# EAGLE design doodle 8 with step and l293 (EAGLE 6.2)
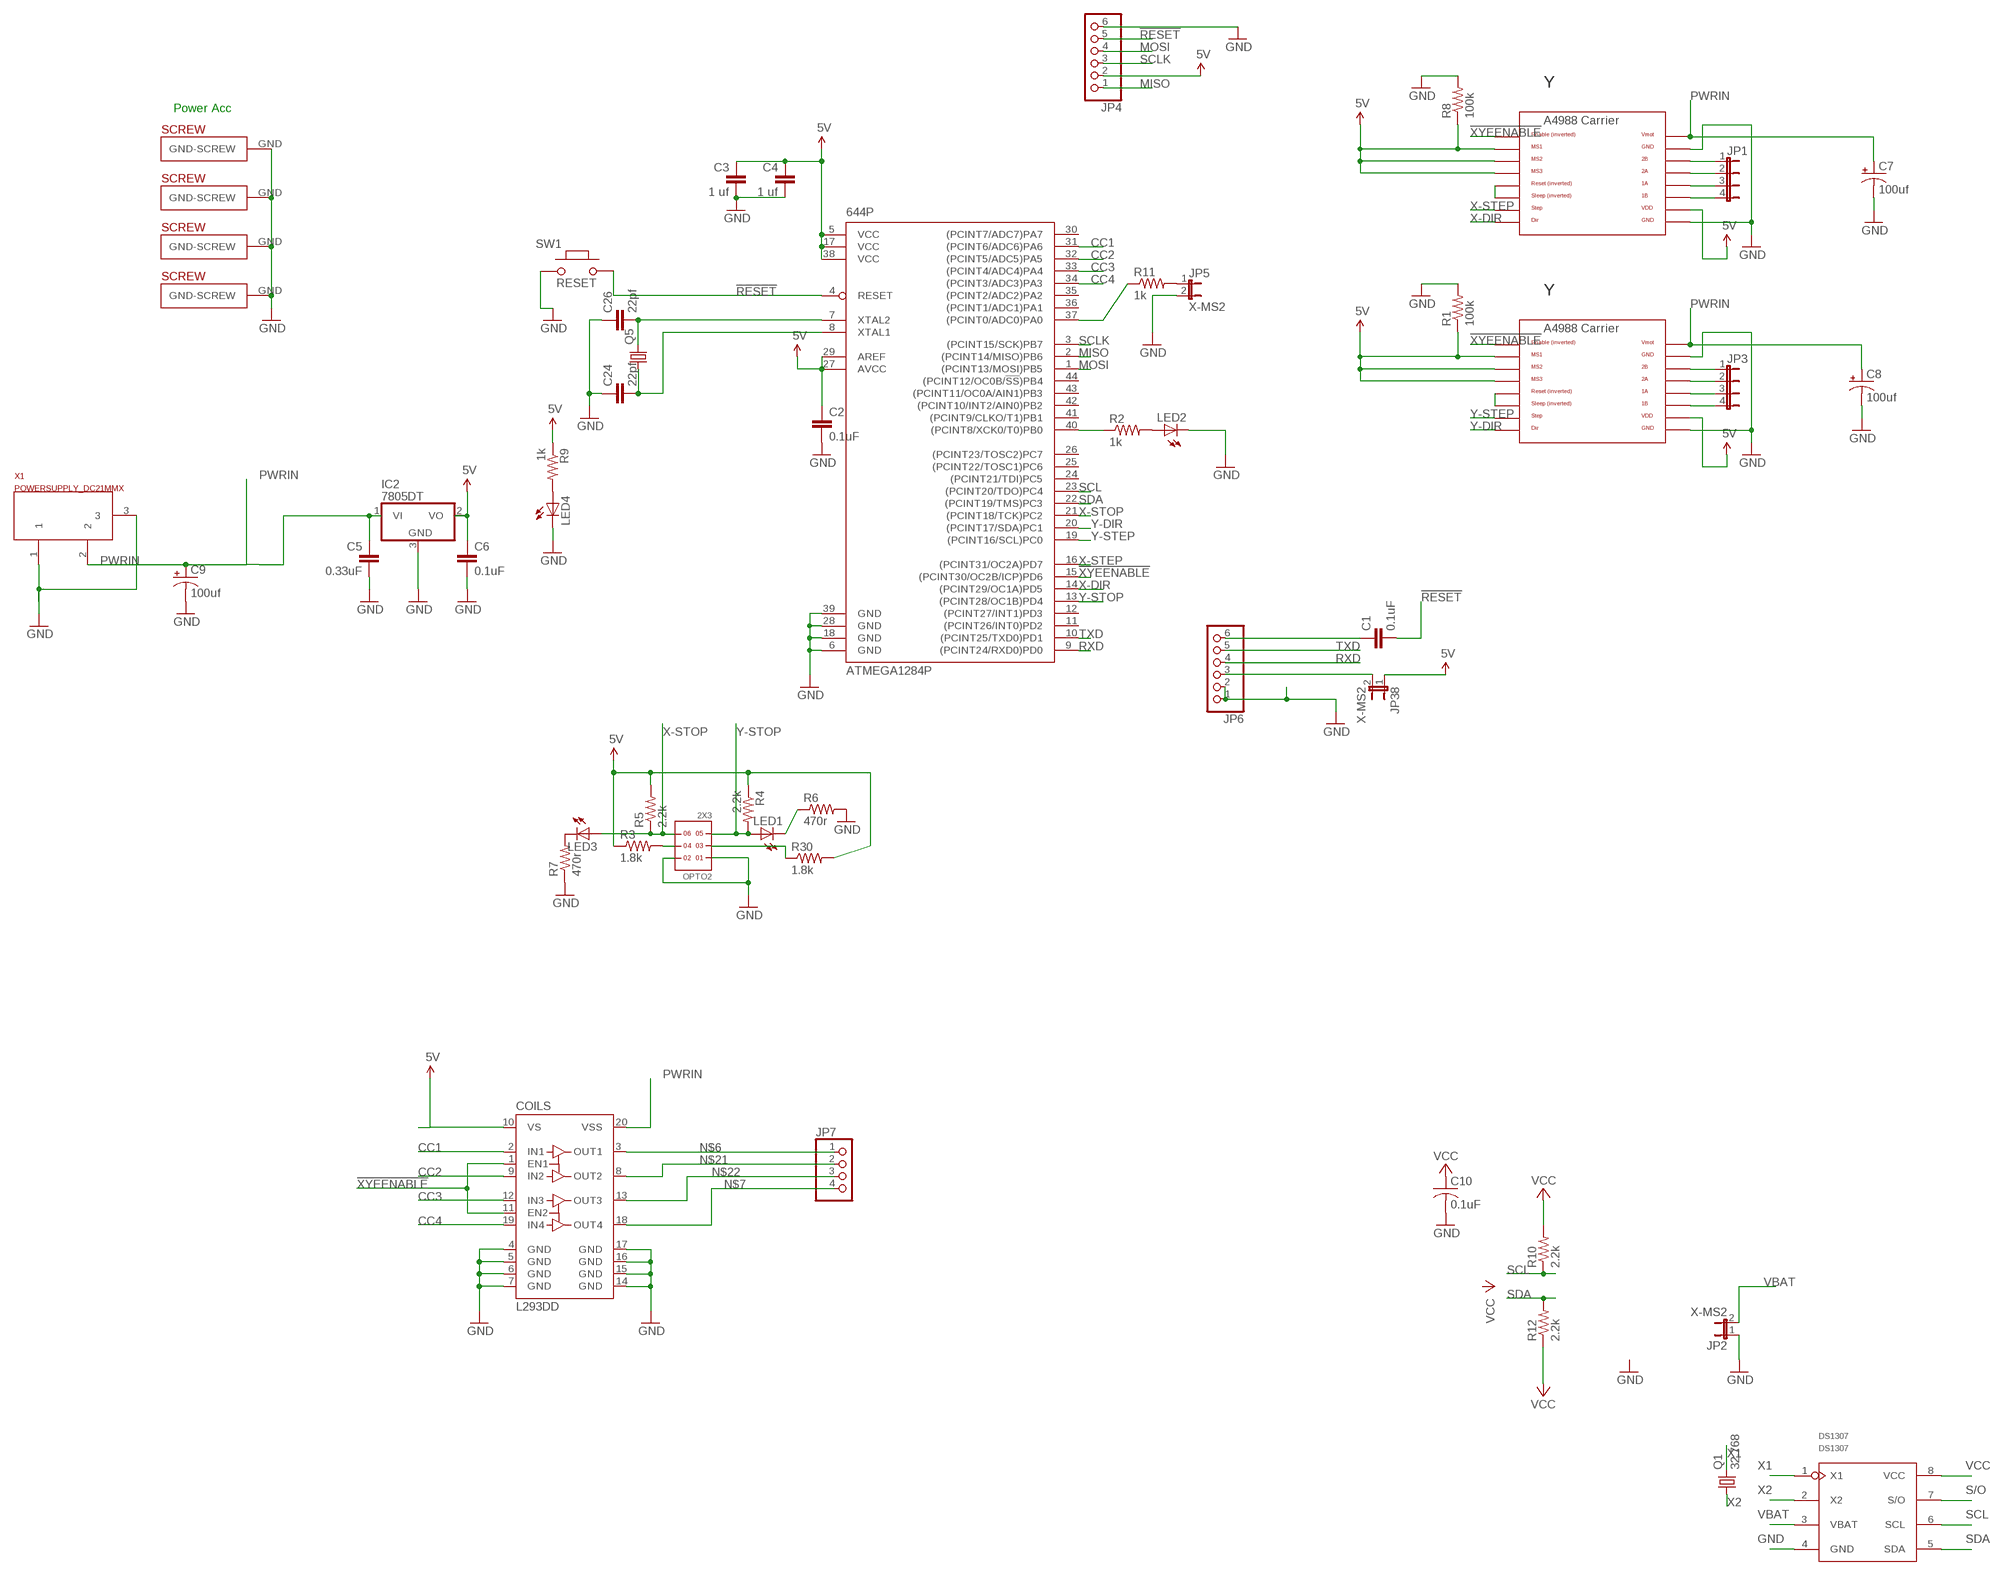
[diagram p0: schematic, sheet 1]

## Parts
644P  ATMEGA1284P  ATMEGA644A  [TQFP44]
C1  0.1uF  CAP0805  [0805]
C2  0.1uF  CAP0805  [0805]
C3  1 uf  CAP0805  [0805]
C4  1 uf  CAP0805  [0805]
C5  0.33uF  CAPPTH2  [CAP-PTH-SMALL2]
C6  0.1uF  CAPPTH2  [CAP-PTH-SMALL2]
C7  100uf  CAP_POLPTH1  [CPOL-RADIAL-100UF-25V]
C8  100uf  CAP_POLPTH1  [CPOL-RADIAL-100UF-25V]
C9  100uf  CAP_POLPTH1  [CPOL-RADIAL-100UF-25V]
C10  0.1uF  C-USC0805  [C0805]
C24  22pf  CAP0805  [0805]
C26  22pf  CAP0805  [0805]
COILS  L293DD  [SO20]
DS1307  DS1307  [SO08]
IC2  7805DT  [TO252]
JP1  JP4E  [JP4]
JP2  X-MS2  JUMPER-2PTH  [1X02]
JP3  JP4E  [JP4]
JP4  PINHD-1X6/90  [1X06/90]
JP5  X-MS2  JUMPER-2PTH  [1X02]
JP6  PINHD-1X6  [1X06]
JP7  PINHD-1X04_2.54  [1X04]
JP38  X-MS2  JUMPER-2PTH  [1X02]
LED1  LEDCHIPLED_0805  [CHIPLED_0805]
LED2  LEDCHIPLED_0805  [CHIPLED_0805]
LED3  LEDCHIPLED_0805  [CHIPLED_0805]
LED4  LEDCHIPLED_0805  [CHIPLED_0805]
OPTO2  2X3  [2X3]
Q1  32.768  CRYTALTC38H  [TC38H]
Q5  CRYSTALHC49S  [HC49/S]
R1  100k  R-US_R0805  [R0805]
R2  1k  R-US_R0805  [R0805]
R3  1.8k  R-US_R0805  [R0805]
R4  2.2k  R-US_R0805  [R0805]
R5  2.2k  R-US_R0805  [R0805]
R6  470r  R-US_R0805  [R0805]
R7  470r  R-US_R0805  [R0805]
R8  100k  R-US_R0805  [R0805]
R9  1k  R-US_R0805  [R0805]
R10  2.2k  R-US_R0805  [R0805]
R11  1k  R-US_R0805  [R0805]
R12  2.2k  R-US_R0805  [R0805]
R30  1.8k  R-US_R0603  [R0603]
SW1  RESET  PB157  [157SW]
U$1  A4988BREAKOUT  [A4988BREAKOUT]
U$7  A4988BREAKOUT  [A4988BREAKOUT]
U$14  PLATED-SCREW  [PLATEDSCREW]
U$17  PLATED-SCREW  [PLATEDSCREW]
U$18  PLATED-SCREW  [PLATEDSCREW]
U$38  PLATED-SCREW  [PLATEDSCREW]
X1  POWERSUPPLY_DC21MMX  [POWERSUPPLY_DC-21MM]

## Nets
5V: 644P.5(VCC) 644P.17(VCC) 644P.27(AVCC) 644P.29(AREF) 644P.38(VCC) C2.1 C3.1 C4.1 C6.1 COILS.10(VS) IC2.2(VO) JP4.2 JP38.1 R1.1 R3.1 R4.1 R5.2 R8.1 R9.1 R30.2 U$1.MS1 U$1.MS2 U$1.MS3 U$1.VDD U$7.MS1 U$7.MS2 U$7.MS3 U$7.VDD
!RESET: 644P.4(RESET) C1.2 JP4.5 SW1.2
!XYEENABLE: 644P.15((PCINT30/OC2B/ICP)PD6) COILS.1(EN1) COILS.11(EN2) U$1.EN U$7.EN
CC1: 644P.31((PCINT6/ADC6)PA6) COILS.2(IN1)
CC2: 644P.32((PCINT5/ADC5)PA5) COILS.9(IN2)
CC3: 644P.33((PCINT4/ADC4)PA4) COILS.12(IN3)
CC4: 644P.34((PCINT3/ADC3)PA3) COILS.19(IN4)
GND: 644P.6(GND) 644P.18(GND) 644P.28(GND) 644P.39(GND) C2.2 C3.2 C4.2 C5.2 C6.2 C7.2(-) C8.2(-) C9.2(-) C10.2 C24.1 C26.1 COILS.4(GND) COILS.5(GND) COILS.6(GND) COILS.7(GND) COILS.14(GND) COILS.15(GND) COILS.16(GND) COILS.17(GND) DS1307.4(GND) IC2.3(GND) JP2.1 JP4.6 JP5.2 JP6.1 JP6.2 LED2.C LED4.C OPTO2.1 OPTO2.2 R1.2 R6.2 R7.1 R8.2 SW1.1 U$1.GND U$1.GND@0(GND) U$7.GND U$7.GND@0(GND) U$14.GND(GND-SCREW) U$17.GND(GND-SCREW) U$18.GND(GND-SCREW) U$38.GND(GND-SCREW) X1.1 X1.3
MISO: 644P.2((PCINT14/MISO)PB6) JP4.1
MOSI: 644P.1((PCINT13/MOSI)PB5) JP4.4
N$1: U$1.RST U$1.SLP(SLEEP)
N$2 [power]: JP3.1 U$1.2B
N$3 [power]: JP3.2 U$1.2A
N$4 [power]: JP3.3 U$1.1A
N$5 [power]: JP3.4 U$1.1B
N$6 [power]: COILS.3(OUT1) JP7.1
N$7 [power]: COILS.18(OUT4) JP7.4
N$8: OPTO2.4 R3.2
N$9: LED2.A R2.2
N$10: 644P.40((PCINT8/XCK0/T0)PB0) R2.1
N$11: LED1.C R6.1
N$12: LED3.C R7.2
N$13: OPTO2.3 R30.1
N$14 [power]: JP1.1 U$7.2B
N$15 [power]: JP1.2 U$7.2A
N$16 [power]: JP1.3 U$7.1A
N$17 [power]: JP1.4 U$7.1B
N$18: 644P.37((PCINT0/ADC0)PA0) R11.1
N$19: LED4.A R9.2
N$20: JP5.1 R11.2
N$21 [power]: COILS.8(OUT2) JP7.2
N$22 [power]: COILS.13(OUT3) JP7.3
N$23: U$7.RST U$7.SLP(SLEEP)
N$70: C1.1 JP6.6
N$71: JP6.3 JP38.2
N$80: 644P.7(XTAL2) C26.2 Q5.2
N$81: 644P.8(XTAL1) C24.2 Q5.1
PWRIN [power]: C5.1 C7.1(+) C8.1(+) C9.1(+) COILS.20(VSS) IC2.1(VI) U$1.VMOT U$7.VMOT X1.2
RXD: 644P.9((PCINT24/RXD0)PD0) JP6.4
S/O: DS1307.7(S/O)
SCL: 644P.23((PCINT20/TDO)PC4) DS1307.6(SCL) R10.1
SCLK: 644P.3((PCINT15/SCK)PB7) JP4.3
SDA: 644P.22((PCINT19/TMS)PC3) DS1307.5(SDA) R12.2
TXD: 644P.10((PCINT25/TXD0)PD1) JP6.5
VBAT: DS1307.3(VBAT) JP2.2
VCC: C10.1 DS1307.8(VCC) R10.2 R12.1
X1: DS1307.1(X1) Q1.2
X2: DS1307.2(X2) Q1.1
X-DIR: 644P.14((PCINT29/OC1A)PD5) U$7.DIR
X-STEP: 644P.16((PCINT31/OC2A)PD7) U$7.STEP
X-STOP: 644P.21((PCINT18/TCK)PC2) LED3.A OPTO2.6 R5.1
Y-DIR: 644P.20((PCINT17/SDA)PC1) U$1.DIR
Y-STEP: 644P.19((PCINT16/SCL)PC0) U$1.STEP
Y-STOP: 644P.13((PCINT28/OC1B)PD4) LED1.A OPTO2.5 R4.2
Unconnected: 644P.11((PCINT26/INT0)PD2) 644P.12((PCINT27/INT1)PD3) 644P.24((PCINT21/TDI)PC5) 644P.25((PCINT22/TOSC1)PC6) 644P.26((PCINT23/TOSC2)PC7) 644P.30((PCINT7/ADC7)PA7) 644P.35((PCINT2/ADC2)PA2) 644P.36((PCINT1/ADC1)PA1) 644P.41((PCINT9/CLKO/T1)PB1) 644P.42((PCINT10/INT2/AIN0)PB2) 644P.43((PCINT11/OC0A/AIN1)PB3) 644P.44((PCINT12/OC0B/!SS!)PB4)

## Notes on the sheet
- Y
- Power Acc
- Y

## Library data of the parts
644P = atmel:ATMEGA644: 8-bit Microcontroller with 64K Bytes In-System Programmable Flash Source: http://www.atmel.com/dyn/resources/prod_documents/doc2593.pdf; MPN: ATMEGA644PV-10AU; OC_FARNELL: 1455123; OC_NEWARK: 58M3748
C1-C6 C24 C26 = SparkFun:CAP: Capacitor Standard 0603 ceramic capacitor, and 0.1" leaded capacitor.
C7-C9 = SparkFun:CAP_POL: Capacitor Polarized These are standard SMD and PTH capacitors. Normally 10uF, 47uF, and 100uF in electrolytic and tantalum varieties. Always verify the external diameter of the through hole cap, it varies with capacity, voltage, and manufacturer. The EIA devices should be standard.
C10 = adafruit:C-US: CAPACITOR, American symbol
COILS = st-microelectronics:L293DD: PUSH-PULL FOUR CHANNEL DRIVER WITH DIODES Source: http://www.st.com/stonline/books/pdf/docs/1330.pdf; OC_FARNELL: unknown
DS1307 = Seeed:DS1307
IC2 = linear:78*: Positive VOLTAGE REGULATOR Source: http://cache.national.com/ds/LM/LM78L05.pdf http://www.fairchildsemi.com/ds/LM/LM7805.pdf
JP1 JP3 = jumper:JP4E: JUMPER
JP2 JP5 JP38 = SparkFun:JUMPER-2: Jumper Basic 0.1" spaced jumper. Use with breakaway headers.
JP4 JP6 = pinhead:PINHD-1X6: PIN HEADER
JP7 = pinhead-2:PINHD-1X04: PIN HEADER
LED1-LED4 = led:LED: LED OSRAM: - CHIPLED LG R971, LG N971, LY N971, LG Q971, LY Q971, LO R971, LY R971 LH N974, LH R974 LS Q976, LO Q976, LY Q976 LO Q996 - Hyper CHIPLED LW Q18S LB Q993, LB Q99A, LB R99A - SideLED LS A670, LO A670, LY A670, LG A670, LP A670 LB A673, LV A673, LT A673, LW A673 LH A674 LY A675 LS A676, LA A676, LO A676, LY A676, LW A676 LS A679, LY A679, LG A679 - Hyper Micro SIDELED® LS Y876, LA Y876, LO Y876, LY Y876 LT Y87S - SmartLED LW L88C, LW L88S LB L89C, LB L89S, LG L890 LS L89K, LO L89K, LY L89K LS L896, LA L896, LO L896, LY L896 - TOPLED LS T670, LO T670, LY T670, LG T670, LP T670 LSG T670, LSP T670, LSY T670, LOP T670, LYG T670 LG T671, LOG T671, LSG T671 LB T673, LV T673, LT T673, LW T673 LH T674 LS T676, LA T676, LO T676, LY T676, LB T676, LH T676, LSB T676, LW T676 LB T67C, LV T67C, LT T67C, LS T67K, LO T67K, LY T67K, LW E67C LS E67B, LA E67B, LO E67B, LY E67B, LB E67C, LV E67C, LT E67C LW T67C LS T679, LY T679, LG T679 LS T770, LO T770, LY T770, LG T770, LP T770 LB T773, LV T773, LT T773, LW T773 LH T774 LS E675, LA E675, LY E675, LS T675 LS T776, LA T776, LO T776, LY T776, LB T776 LHGB T686 LT T68C, LB T68C - Hyper Mini TOPLED® LB M676 - Mini TOPLED Santana® LG M470 LS M47K, LO M47K, LY M47K Source: http://www.osram.convergy.de LUXEON: - LUMILED® LXK2-PW12-R00, LXK2-PW12-S00, LXK2-PW14-U00, LXK2-PW14-V00 LXK2-PM12-R00, LXK2-PM12-S00, LXK2-PM14-U00 LXK2-PE12-Q00, LXK2-PE12-R00, LXK2-PE12-S00, LXK2-PE14-T00, LXK2-PE14-U00 LXK2-PB12-K00, LXK2-PB12-L00, LXK2-PB12-M00, LXK2-PB14-N00, LXK2-PB14-P00, LXK2-PB14-Q00 LXK2-PR12-L00, LXK2-PR12-M00, LXK2-PR14-Q00, LXK2-PR14-R00 LXK2-PD12-Q00, LXK2-PD12-R00, LXK2-PD12-S00 LXK2-PH12-R00, LXK2-PH12-S00 LXK2-PL12-P00, LXK2-PL12-Q00, LXK2-PL12-R00 Source: www.luxeon.com KINGBRIGHT: KA-3528ASYC Source: www.kingbright.com
OPTO2 = headers(2mm):2X3
Q1 = crystal:CRYTAL: CRYSTAL
Q5 = crystal:CRYSTAL: CRYSTAL; OC_FARNELL: 1667008; OC_NEWARK: unknown
R1-R12 R30 = resistor:R-US_: RESISTOR, American symbol
SW1 = MySMD:PB157
U$1 U$7 = RepRapjr:A4988BREAKOUT
U$14 U$17 U$18 U$38 = Sanguinololu:PLATED-SCREW
X1 = SmartPrj:POWERSUPPLY_DC21MM

## Net classes
1 power: width 1.27 mm, drill 1.016 mm

## Board
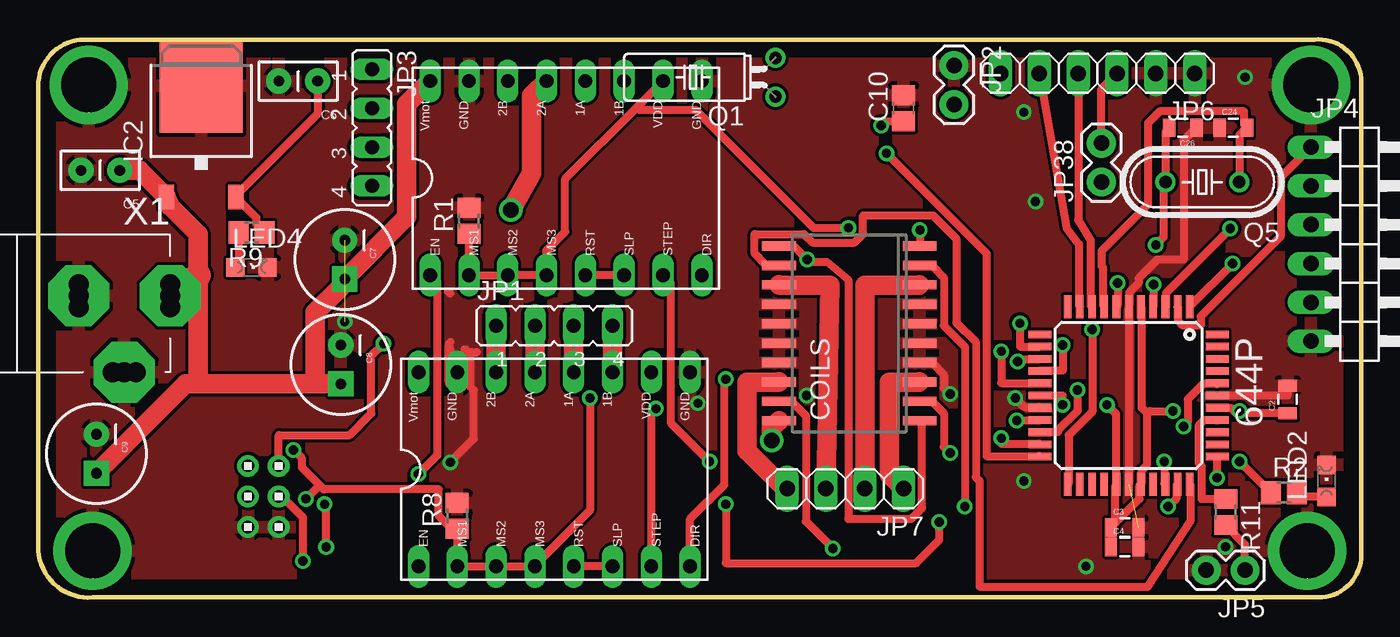
[diagram p1: board, top side]
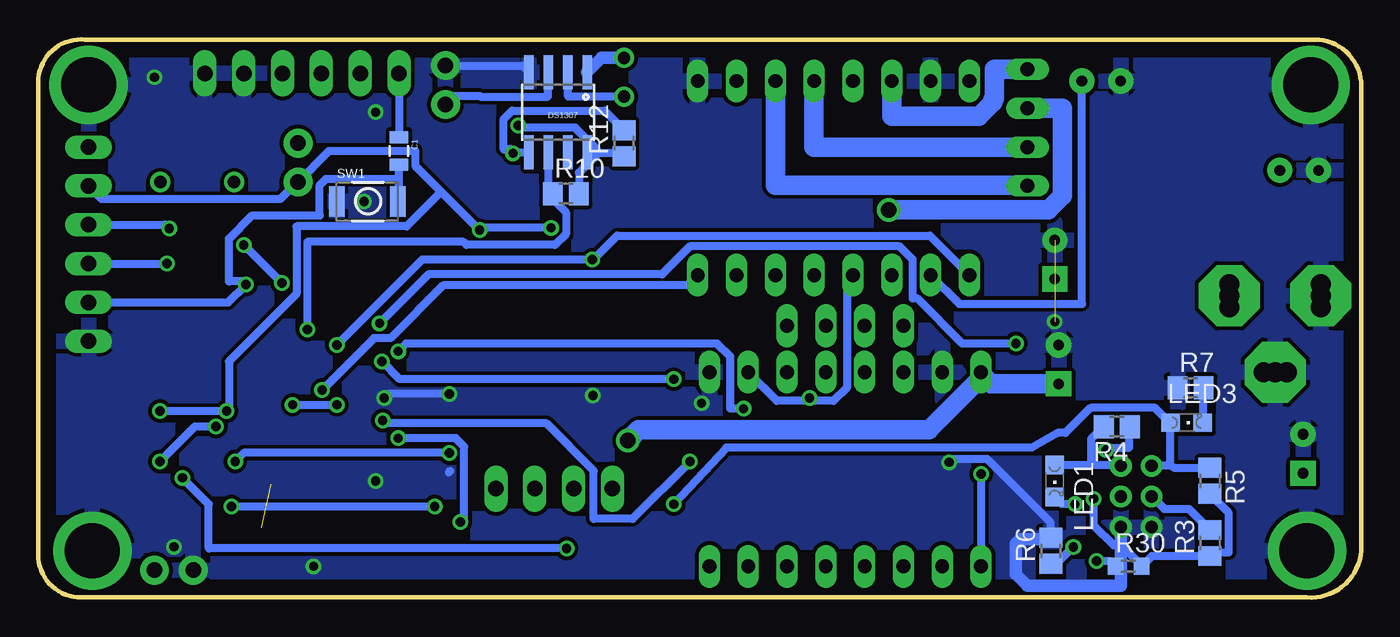
[diagram p2: board, bottom side, seen from below]

Size 86.61 x 36.52 mm. Coordinates in mm from the lower left corner, seen from the top.
Outline: 0,33.46 0,3.06 arc90 3.56,0.01 84.05,0.01 arc90 86.59,3.06 86.59,33.97 arc90 83.55,36.51 3.05,36.51 arc90 0,33.46
Copper layers (1*16): Top 0.035mm / dielectric 1.5mm / Bottom 0.035mm
Design rules: minimum track width 20mil, minimum drill 24mil, track to track 8mil, track to pad 8mil, pad to pad 8mil, via to via 8mil, smd to smd 8mil, copper to edge 40mil, drill to drill 8mil, minimum pad ring 10mil, minimum via ring 8mil, stop-mask expansion 4mil, vias tented up to drill 0mil, thermal gap 10mil

### Footprints (pad centres in the part's own frame; a part is rotated, then mirrored left to right if it is on the bottom)
TQFP44 = smd 1.5 x 0.5: 1 -5.8,4; 2 -5.8,3.2; 3 -5.8,2.4; 4 -5.8,1.6; 5 -5.8,0.8; 6 -5.8,0; 7 -5.8,-0.8; 8 -5.8,-1.6; 9 -5.8,-2.4; 10 -5.8,-3.2; 11 -5.8,-4; 23 5.8,-4; 24 5.8,-3.2; 25 5.8,-2.4; 26 5.8,-1.6; 27 5.8,-0.8; 28 5.8,0; 29 5.8,0.8; 30 5.8,1.6; 31 5.8,2.4; 32 5.8,3.2; 33 5.8,4 | smd 0.5 x 1.5: 12 -4,-5.8; 13 -3.2,-5.8; 14 -2.4,-5.8; 15 -1.6,-5.8; 16 -0.8,-5.8; 17 0,-5.8; 18 0.8,-5.8; 19 1.6,-5.8; 20 2.4,-5.8; 21 3.2,-5.8; 22 4,-5.8; 34 4,5.8; 35 3.2,5.8; 36 2.4,5.8; 37 1.6,5.8; 38 0.8,5.8; 39 0,5.8; 40 -0.8,5.8; 41 -1.6,5.8; 42 -2.4,5.8; 43 -3.2,5.8; 44 -4,5.8
0805 = smd 0.8 x 1.2: 1 -0.9,0; 2 0.9,0
CAP-PTH-SMALL2 = drill 0.7 pad 1.651: 1 0,0; 2 2.54,0
CPOL-RADIAL-100UF-25V = drill 0.7 pad 1.651 square: 1 1.27,0 | drill 0.7 pad 1.651: 2 -1.27,0
C0805 = smd 1.3 x 1.5: 1 -0.85,0; 2 0.85,0
SO20 = smd 0.6 x 2.2: 1 -5.715,-4.6; 2 -4.445,-4.6; 3 -3.175,-4.6; 4 -1.905,-4.6; 5 -0.635,-4.6; 6 0.635,-4.6; 7 1.905,-4.6; 8 3.175,-4.6; 9 4.445,-4.6; 10 5.715,-4.6; 11 5.715,4.6; 12 4.445,4.6; 13 3.175,4.6; 14 1.905,4.6; 15 0.635,4.6; 16 -0.635,4.6; 17 -1.905,4.6; 18 -3.175,4.6; 19 -4.445,4.6; 20 -5.715,4.6
SO08 = smd 0.61 x 2.21: 1 -1.905,-2.616; 2 -0.635,-2.616; 3 0.635,-2.616; 4 1.905,-2.616; 5 1.905,2.616; 6 0.635,2.616; 7 -0.635,2.616; 8 -1.905,2.616
TO252 = smd 1 x 1.6: 1 -2.28,-4.8; 2 2.28,-4.8 | smd 5.4 x 6.2: 3 0,2.5
JP4 = drill 0.914 long: 1 -3.81,0; 2 -1.27,0; 3 1.27,0; 4 3.81,0
1X02 = drill 1.016 pad 1.88: 1 0,0; 2 2.54,0
1X06/90 = drill 1.016 long: 1 -6.35,-3.81; 2 -3.81,-3.81; 3 -1.27,-3.81; 4 1.27,-3.81; 5 3.81,-3.81; 6 6.35,-3.81
1X06 = drill 1.016 long: 1 -6.35,0; 2 -3.81,0; 3 -1.27,0; 4 1.27,0; 5 3.81,0; 6 6.35,0
1X04 = drill 1.016 long: 1 -3.81,0; 2 -1.27,0; 3 1.27,0; 4 3.81,0
CHIPLED_0805 = smd 1.2 x 1.2: A 0,-1.05; C 0,1.05
2X3 = drill 0.8 pad 1.422: 1 -2,-1; 2 -2,1; 3 0,-1; 4 0,1; 5 2,-1; 6 2,1
TC38H = drill 0.813: 1 -1.27,0; 2 1.27,0
HC49/S = drill 0.813: 1 -2.413,0; 2 2.413,0
R0805 = smd 1.3 x 1.5: 1 -0.85,0; 2 0.85,0
R0603 = smd 1 x 1.1: 1 -0.85,0; 2 0.85,0
157SW = smd 1.016 x 1.981: 1 0,0; 2 4,0
A4988BREAKOUT = drill 0.9 long: 1A 8.89,1.27; 1B 11.43,1.27; 2A 6.35,1.27; 2B 3.81,1.27; DIR 16.51,-11.43; EN -1.27,-11.43; GND 16.51,1.27; GND@0 1.27,1.27; MS1 1.27,-11.43; MS2 3.81,-11.43; MS3 6.35,-11.43; RST 8.89,-11.43; SLP 11.43,-11.43; STEP 13.97,-11.43; VDD 13.97,1.27; VMOT -1.27,1.27
PLATEDSCREW = drill 3.6: GND 0,0
POWERSUPPLY_DC-21MM = drill 1.3 pad 4 octagon: 1 -5.08,-3.353; 2 -0.076,-6.35; 3 -0.076,-0.356 | drill 1.3: 4 -5.08,-4.115; 5 -5.08,-2.591; 6 -0.838,-0.356; 7 0.686,-0.356; 8 -0.838,-6.35; 9 0.686,-6.35

### Placement (x,y rotation side)
644P  71.37,13.22 270 top
C1  62.99,29.22 270 bottom
C2  81.79,12.96 90 top
C3  71.12,4.58 0 top
C4  71.12,3.31 0 top
C5  5.33,27.95 180 top
C6  18.29,33.79 180 top
C7  20.07,22.11 270 top
C8  19.81,15.25 270 top
C9  3.81,9.41 270 top
C10  56.64,32.01 90 top
C24  78.23,30.74 0 top
C26  74.93,30.74 180 top
COILS  53.09,17.28 90 top
DS1307  52.58,31.76 180 bottom
IC2  10.67,31 0 top
JP1  33.78,17.79 0 top
JP2  59.94,34.81 270 top
JP3  21.84,30.74 270 top
JP4  87.12,23.12 270 top
JP5  78.99,1.79 180 top
JP6  69.34,34.3 180 top
JP7  52.83,7.12 180 top
JP38  69.6,27.19 90 top
LED1  20.07,7.63 180 bottom
LED2  84.33,7.63 0 top
LED3  11.43,11.44 270 bottom
LED4  13.97,21.6 270 top
OPTO2  14.73,6.61 90 top
Q1  48.26,34.05 90 top
Q5  76.2,27.19 180 top
R1  28.19,24.65 90 top
R2  81.53,6.87 0 top
R3  9.91,3.57 90 bottom
R4  16,11.19 180 bottom
R5  9.91,7.63 270 bottom
R6  20.32,3.06 90 bottom
R7  11.18,13.73 0 bottom
R8  27.43,5.34 90 top
R9  13.97,23.89 180 top
R10  52.07,26.43 0 bottom
R11  77.72,5.6 270 top
R12  48.26,29.73 90 bottom
R30  15.24,2.04 0 bottom
SW1  67.06,25.92 0 bottom
U$1  26.92,32.52 0 top
U$7  26.16,13.47 0 top
U$14  3.3,33.54 0 top
U$17  3.56,3.06 0 top
U$18  83.06,3.06 0 top
U$38  83.31,33.54 0 top
X1  2.29,19.82 90 top

### Tracks (layer width: path | path; a pad name or v marks a point on that pad's centre or on a via)
5V  (via drill 0.61)
  Top 0.508: 78.64,12.1 78.38,12.1 78.08,12.4 77.22,12.4 644P.38 | 78.64,12.1 81.79,12.1 C2.1 | C4.1 70.26,3.31 70.26,4.58 C3.1 70.41,4.78 70.51,4.89 70.51,5.09 | 70.51,5.09 70.51,7.32 70.56,7.38 644P.27 70.56,7.68 70.56,12 v69.95,12.61 | 70.51,5.09 70.71,5.09 72.08,6.46 72.08,7.32 72.14,7.38 644P.29 72.24,7.63 72.24,8.34 72.59,8.7 72.59,12.05 | 644P.17 67.06,13.22 v67.06,12.61 | 72.59,12.05 72.24,12.4 72.24,18.96 72.19,19.01 644P.5 | v74.27,12.2 72.8,12.2 72.59,12.05 | v78.64,12.2 78.64,12.1 | v57.71,24.04 57.71,23.02 COILS.10 | v16.71,9.66 17.27,9.1 17.27,8.49 18.41,7.35 | 18.41,7.35 18.69,7.07 26.21,7.07 26.21,5.34 27.03,4.53 27.43,4.53 R8.1 U$7.MS1 U$7.MS2 U$7.MS3 32.66,2.24 36.12,5.7 v36.12,13.07 | 18.41,7.35 v17.53,6.46 | R9.1 14.78,23.89 14.27,24.39 14.27,24.85 12.95,26.17 IC2.2 13.06,26.43 18.29,31.66 C6.1 | R1.1 U$1.MS1 U$1.MS2 U$1.MS3 33.27,22.72 34.49,23.94 34.49,27.39 39.19,32.09 | 39.19,32.09 U$1.VDD | v53.04,24.19 50.75,24.19 43.03,31.91 39.37,31.91 39.19,32.09
  Bottom 0.508: v69.95,12.61 v67.06,12.61 | v78.64,12.2 v74.27,12.2 74.12,12.4 74.12,15.45 69.7,19.87 69.7,24.29 62.48,24.29 60.22,26.55 | 60.22,26.55 61.93,28.25 61.93,29.22 67.56,29.22 JP38.1 69.8,27.04 70.76,26.07 82.45,26.07 JP4.2 | 60.22,26.55 v57.71,24.04 57.51,24.19 v53.04,24.19 | R5.2 9.91,6.77 8.69,5.55 8.69,2.96 9.8,2.96 R3.1 9.91,2.7 13.72,2.7 14.38,2.04 R30.2 14.53,2.24 15.7,3.41 16.2,3.41 17.53,4.73 v17.53,6.46 | v16.71,9.66 16.56,9.81 15.19,9.81 15.19,11.19 R4.1 | U$7.VDD 38.25,12.86 36.12,12.86 | 36.12,12.86 34.54,12.86 33.68,13.73 33.68,21.09 U$1.MS3 | C6.1 18.29,19.21 26.31,19.21 U$1.MS1 | v36.12,13.07 36.12,12.86
!RESET  (via drill 0.61)
  Top 0.508: v73,20.48 73,19.06 644P.4
  Bottom 0.508: 62.99,27.39 62.99,25.92 SW1.2 | 62.99,27.39 C1.2 | JP4.5 74.17,19.31 v73,20.48 73.15,20.69 74.12,20.69 74.12,23.48 72.59,25 68.17,25 68.17,26.98 67.77,27.39 62.99,27.39
!XYEENABLE  (via drill 0.61)
  Top 0.508: v24.89,8.09 26.11,9.31 26.11,20.63 U$1.EN | v67.06,16.52 67.06,14.84 65.58,14.84 644P.15 | COILS.11 48.51,22.97 49.48,22.97 v50.34,22.11 50.55,21.96 51.61,21.96 53.04,20.79 53.04,5.14 57.15,5.14 57.86,5.85 57.86,11.39 57.71,11.54 COILS.1
  Bottom 0.508: v24.89,8.09 U$7.EN | v67.06,16.52 61.47,22.11 v50.34,22.11 50.14,22.26 48.72,23.68 28.24,23.68 U$1.EN
CC1  (via drill 0.61)
  Top 0.508: v73.71,8.9 73.71,7.48 73.76,7.43 644P.31 | v59.69,9.46 59.28,9.86 59.28,12.05 58.52,12.81 57.71,12.81 COILS.2
  Bottom 0.508: v73.71,8.9 73.15,9.46 v59.69,9.46
CC2  (via drill 0.61)
  Top 0.508: v73.96,5.95 74.52,6.51 74.52,7.38 644P.32 | v60.66,5.95 60.66,16.42 59.28,17.79 59.28,20.94 58.52,21.7 57.71,21.7 COILS.9
  Bottom 0.508: v60.66,5.95 v73.96,5.95
CC3
  Top 0.508: 644P.33 75.39,7.38 75.44,7.32 75.44,5.04 72.64,0.72 61.62,0.72 61.62,7.63 61.37,7.88 61.37,16.72 60.1,17.99 60.1,23.48 58.57,25 54,25 54,23.78 53.44,23.23 50.7,23.23 50.14,23.78 46.89,23.78 46.89,22.51 47.65,21.75 48.46,21.75 COILS.12
CC4  (via drill 0.61)
  Top 0.508: v77.16,7.83 77.16,9.2 644P.34 | v52.02,3.21 50.24,4.99 50.24,11.9 49.33,12.81 48.51,12.81 COILS.19
  Bottom 0.508: v77.16,7.83 75.44,6.11 75.44,3.21 v52.02,3.21
GND  (via drill 0.6, 0.61)  (2 unrouted)
  Top 0.508: 644P.28 644P.6 71.42,19.26 71.42,19.97 72.03,20.58 72.03,20.89 73.25,22.11 74.98,22.11 74.98,29.93 75.79,30.74 C26.1 | v63.96,13.07 64.57,12.46 65.53,12.46 644P.18 | v59.69,13.32 59.28,13.73 59.28,14.59 58.52,15.35 57.71,15.35 COILS.4 | 644P.39 81.79,13.22 C2.2 | 26.82,20.02 26.97,19.9 | 28.4,16.06 28.73,16.06 | v26.97,8.85 28.5,10.37 28.5,13.57 28.3,13.78 28.3,15.81 28.24,15.81 28.24,14.49 28.19,14.49 28.19,15.86 28.14,15.86 28.14,14.23 28.09,14.23 28.09,16.11 28.04,16.11 28.04,14.03 27.99,14.03 27.94,14.08 27.94,14.54 27.89,14.54 27.74,14.39 27.74,14.28 27.28,14.28 27.28,14.03 27.94,14.03 27.99,14.08 27.99,16.21 27.89,16.21 27.89,14.59 27.69,14.39 27.69,14.34 27.23,14.34 27.23,13.93 27.18,13.93 27.18,14.39 27.13,14.39 27.13,13.98 27.08,13.98 27.08,14.49 27.03,14.49 27.03,13.98 26.97,13.93 26.87,14.03 26.92,14.08 26.92,16.27 26.97,16.27 26.97,14.03 26.92,14.03 26.87,14.08 26.87,16.37 26.97,16.73 | U$7.GND@0
  Bottom 0.508: v63.96,13.07 63.7,13.32 v59.69,13.32 | DS1307.4 54.91,34.81 JP2.1 | 59.64,8.29 59.74,8.19 | v26.97,8.85 26.77,9.05 24.49,9.05 20.32,4.89 R6.2
  Bottom 0.813: OPTO2.1 15.73,0.79 15.75,0.77 21.84,0.77 22.61,1.53 22.61,3.57 22.35,3.82 20.41,3.82 R6.2
  other vias: 20.07,18.04 78.99,34.05 64.52,31.76 65.28,25.92 68.58,2.04 43.18,12.71 50.29,13.22 77.72,3.31 64.52,7.63
  pour Bottom (isolate 0.254): 3.01,37.51 84.96,37.51 arc-90 88.01,34.46 88.01,2.51 88.01,1.81 arc-90 84.96,-1.24 3.01,-1.24 2.31,-1.24 arc-90 -0.74,1.81 -0.74,33.76 -0.74,34.46 arc-90 2.31,37.51
  pour Top: 3.01,37.51 84.96,37.51 arc-90 88.01,34.46 88.01,32.51 88.01,1.81 arc-90 84.96,-1.24 83.01,-1.24 2.31,-1.24 arc-90 -0.74,1.81 -0.74,33.76 -0.74,34.46 arc-90 2.31,37.51
MISO
  Top 0.508: JP4.1 81.33,27.49 81.33,23.63 76.1,18.4 76.1,17.79 74.93,17.79 74.62,18.09 74.62,18.96 74.57,19.01 644P.2
MOSI  (via drill 0.61)
  Top 0.508: v78.18,21.85 75.39,19.06 644P.1
  Bottom 0.508: JP4.4 v78.18,21.85
N$1
  Top 0.508: U$1.SLP U$1.RST
N$2
  Bottom 1.27: U$1.2B 30.73,31.51 25.04,31.51 24.13,32.42 24.13,32.57 24.03,32.67 24.03,34.55 JP3.1
N$3  (via drill 1.02)
  Top 1.27: U$1.2A 32.31,32.83 32.31,27.75 v30.94,25.36
  Bottom 1.27: v30.94,25.36 20.47,25.36 19.56,26.27 19.56,32.01 JP3.2
N$4
  Bottom 1.27: U$1.1A 35.81,29.47 JP3.3
N$5
  Bottom 1.27: U$1.1B 38.35,26.98 21.89,26.98 JP3.4
N$6
  Top 1.27: JP7.1 55.73,8.04 55.73,14.08 57.66,14.08 COILS.3
N$7
  Top 1.27: JP7.4 48.87,7.12 46.38,9.61 46.38,14.08 48.46,14.08 COILS.18
N$8
  Bottom 0.508: R3.2 11.28,5.8 12.9,5.8 13.72,6.61 OPTO2.4
N$9
  Top 0.508: LED2.A 84.33,6.61 82.4,6.61 R2.2
N$10  (via drill 0.61)
  Top 0.508: v78.64,8.9 80.67,6.87 R2.1 | v74.98,11.19 75.23,11.44 75.23,12.96 76.25,13.98 77.16,13.98 644P.40
  Bottom 0.508: v78.64,8.9 76.35,11.19 v74.98,11.19
N$11  (via drill 0.61)
  Top 0.508: v18.74,6.11 18.85,6 v18.85,3.31
  Bottom 0.508: v18.74,6.11 19.61,6.11 20.07,6.56 LED1.C | v18.85,3.31 19.91,2.24 20.32,2.24 R6.1
N$12
  Bottom 0.508: LED3.C 10.36,11.44 10.36,13.73 R7.2
N$13  (via drill 0.61)
  Top 0.508: v17.32,2.4 17.32,5.24 15.95,6.61 OPTO2.3
  Bottom 0.508: v17.32,2.4 16.46,2.4 16.1,2.04 R30.1
N$14
  Top 1.27: JP1.1 U$7.2B
N$15
  Top 1.27: JP1.2 U$7.2A
N$16
  Top 1.27: JP1.3 U$7.1A
N$17
  Top 1.27: JP1.4 U$7.1B
N$18
  Top 0.508: R11.1 77.72,6.46 76.15,6.46 76.15,8.59 75.95,8.8 75.95,11.24 76.3,11.59 77.16,11.59 644P.37
N$19
  Top 0.508: LED4.A 12.95,21.6 13.11,21.75 13.11,23.89 R9.2
N$20
  Top 0.508: JP5.1 78.99,3.46 77.72,4.73 R11.2
N$21
  Top 1.27: JP7.2 54.1,20.43 57.66,20.43 COILS.8
N$22
  Top 1.27: JP7.3 51.82,20.43 48.51,20.43 COILS.13
N$23
  Top 0.508: U$7.SLP U$7.RST
N$70
  Bottom 0.508: JP6.6 C1.1
N$71
  Top 0.508: JP6.3 69.6,33.28 JP38.2
N$80  (via drill 0.61)
  Top 0.508: C26.2 74.02,30.74 73.81,30.54 73.81,27.19 Q5.2 73.66,26.98 73.66,23.58 v73.15,23.07 | v70.66,20.58 70.66,19.11 70.61,19.06 644P.7
  Bottom 0.508: v73.15,23.07 v70.66,20.58
N$81
  Top 0.508: Q5.1 78.64,27.19 78.64,30.29 79.1,30.74 C24.2 78.94,30.95 78.94,31.81 73.41,31.81 72.64,31.05 72.64,25.71 69.6,22.67 69.6,21.7 69.7,21.6 69.7,19.11 69.75,19.06 644P.8
PWRIN  (via drill 1.02)
  Top 1.27: v48.01,10.27 48.01,11.08 48.46,11.54 COILS.20 | U$1.VMOT 24.13,32.27 24.13,24.9 C7.1 19.76,20.28 18.14,18.65 18.14,13.98 | C5.1 6.66,27.95 8.38,26.22 IC2.1 8.64,25.61 10.46,23.78 10.46,21.09 10.46,13.98 | C9.1 9.65,13.98 10.46,13.98 | C8.1 18.14,13.98 | 18.14,13.98 10.46,13.98
  Top 1.676: X1.2 9.12,19.75 10.46,21.09
  Bottom 1.27: v48.01,10.27 47.3,10.98 28.3,10.98 24.89,14.39 U$7.VMOT 24.33,14.08 24.23,13.98 C8.1
RXD
  Top 0.508: JP6.4 68.07,24.7 68.88,23.38 68.88,19.11 68.94,19.06 644P.9
SCL  (via drill 0.61)
  Top 0.508: v68.99,17.54 68.99,12.15 67.46,10.63 67.46,7.48 67.41,7.43 644P.23
  Bottom 0.508: v68.99,17.54 68.99,23.28 58.78,23.28 58.57,23.07 52.78,23.07 52.07,23.78 52.07,25.21 52.88,26.02 52.88,26.43 R10.1 53.04,26.63 53.19,26.63 53.19,29.12 DS1307.6
SCLK  (via drill 0.61)
  Top 0.508: v78.03,24.14 73.81,19.92 73.81,19.06 644P.3
  Bottom 0.508: v78.03,24.14 78.28,24.39 JP4.3
SDA  (via drill 0.61)
  Top 0.508: v55.52,29.07 62.08,22.51 62.08,9.26 65.53,9.26 644P.22
  Bottom 0.508: DS1307.5 54.51,29.12 55.47,29.12 v55.52,29.07 55.63,29.32 56.13,29.32 56.13,31.3 55.58,31.86 49.53,31.86 48.26,30.59 R12.2
TXD
  Top 0.508: JP6.5 67.31,24.19 68.12,23.12 68.12,19.11 68.17,19.06 644P.10
VBAT
  Bottom 0.508: JP2.2 59.39,32.83 57.71,32.83 57.66,32.78 53.24,32.78 53.24,34.35 DS1307.3
VCC  (via drill 0.61)
  Top 0.508: v55.17,30.9 55.17,31.15 C10.1
  Bottom 0.508: 50.09,29.12 50.65,29.12 DS1307.8 | 50.09,29.12 50.04,29.12 | 50.04,29.12 48.46,29.12 48.26,28.91 R12.1 | R10.2 51.21,26.43 51.21,27.8 50.09,28.91 50.09,29.12 | v55.17,30.9 55.02,30.74 51.46,30.74 50.04,29.32 50.04,29.12
X1
  Bottom 0.813: Q1.2 49.73,35.32 DS1307.1
X2
  Bottom 0.508: Q1.1 51.92,32.78 51.92,34.35 DS1307.2
X-DIR  (via drill 0.61)
  Top 0.508: v64.11,15.45 64.11,15.61 65.53,15.61 644P.14 | v45.01,14.28 44.91,14.18 44.91,7.38 42.67,5.14 U$7.DIR
  Bottom 0.508: v64.11,15.45 62.94,14.28 v45.01,14.28
X-STEP  (via drill 0.61)
  Top 0.508: v63.04,16.11 63.04,14.03 65.53,14.03 644P.16 | v40.44,12.35 40.13,12.05 U$7.STEP
  Bottom 0.508: v63.04,16.11 62.54,16.62 42.16,16.62 41.3,15.76 41.3,12.35 v40.44,12.35
X-STOP  (via drill 0.61)
  Top 0.508: v63.04,10.42 63.04,10.07 65.53,10.07 644P.21 | v58.98,4.94 58.98,3.77 57.46,2.24 45.01,2.24 v45.01,6.11
  Bottom 0.508: 12.5,8.65 12.5,11.44 LED3.A 12.7,11.59 13.51,12.4 17.73,12.4 19.36,10.78 19.86,10.78 21.59,9.81 41.55,9.81 v45.01,6.11 | 12.5,8.65 13.72,8.65 OPTO2.6 | R5.1 9.91,8.49 12.29,8.49 12.5,8.65 | v63.04,10.42 59.28,10.42 58.73,9.86 58.73,4.94 v58.98,4.94
Y-DIR  (via drill 0.61)
  Top 0.508: v68.02,13.57 68.02,12.2 66.75,10.93 66.75,10.83 644P.20
  Bottom 0.508: v68.02,13.57 64.62,16.98 63.55,16.98 60.1,20.43 44.09,20.43 U$1.DIR
Y-STEP  (via drill 0.61)
  Top 0.508: v64.06,11.59 65.53,11.59 644P.19 | v43.94,8.9 41.4,11.44 41.4,20.58 U$1.STEP
  Bottom 0.508: v64.06,11.59 63.86,11.39 53.34,11.39 50.24,8.29 50.24,5.14 47.7,5.14 v43.94,8.9
Y-STOP  (via drill 0.61)
  Top 0.508: v64.26,17.94 64.26,16.42 65.53,16.42 644P.13 | v22.61,16.62 21.79,15.81 21.79,12.05 20.37,10.63 15.75,10.63 15.75,8.65 OPTO2.5
  Bottom 0.508: 17.68,8.65 15.75,8.65 OPTO2.5 | 17.68,8.65 20.07,8.65 LED1.A | 17.68,8.65 17.68,10.37 16.87,11.19 R4.2 | v64.26,17.94 61.06,21.14 45.77,21.14 43.94,22.97 30.23,22.97 29.36,22.11 29.36,19.57 29.06,19.57 26.11,16.62 v22.61,16.62